# Altium schematic sheet mega128原理图.SchDoc
size A4
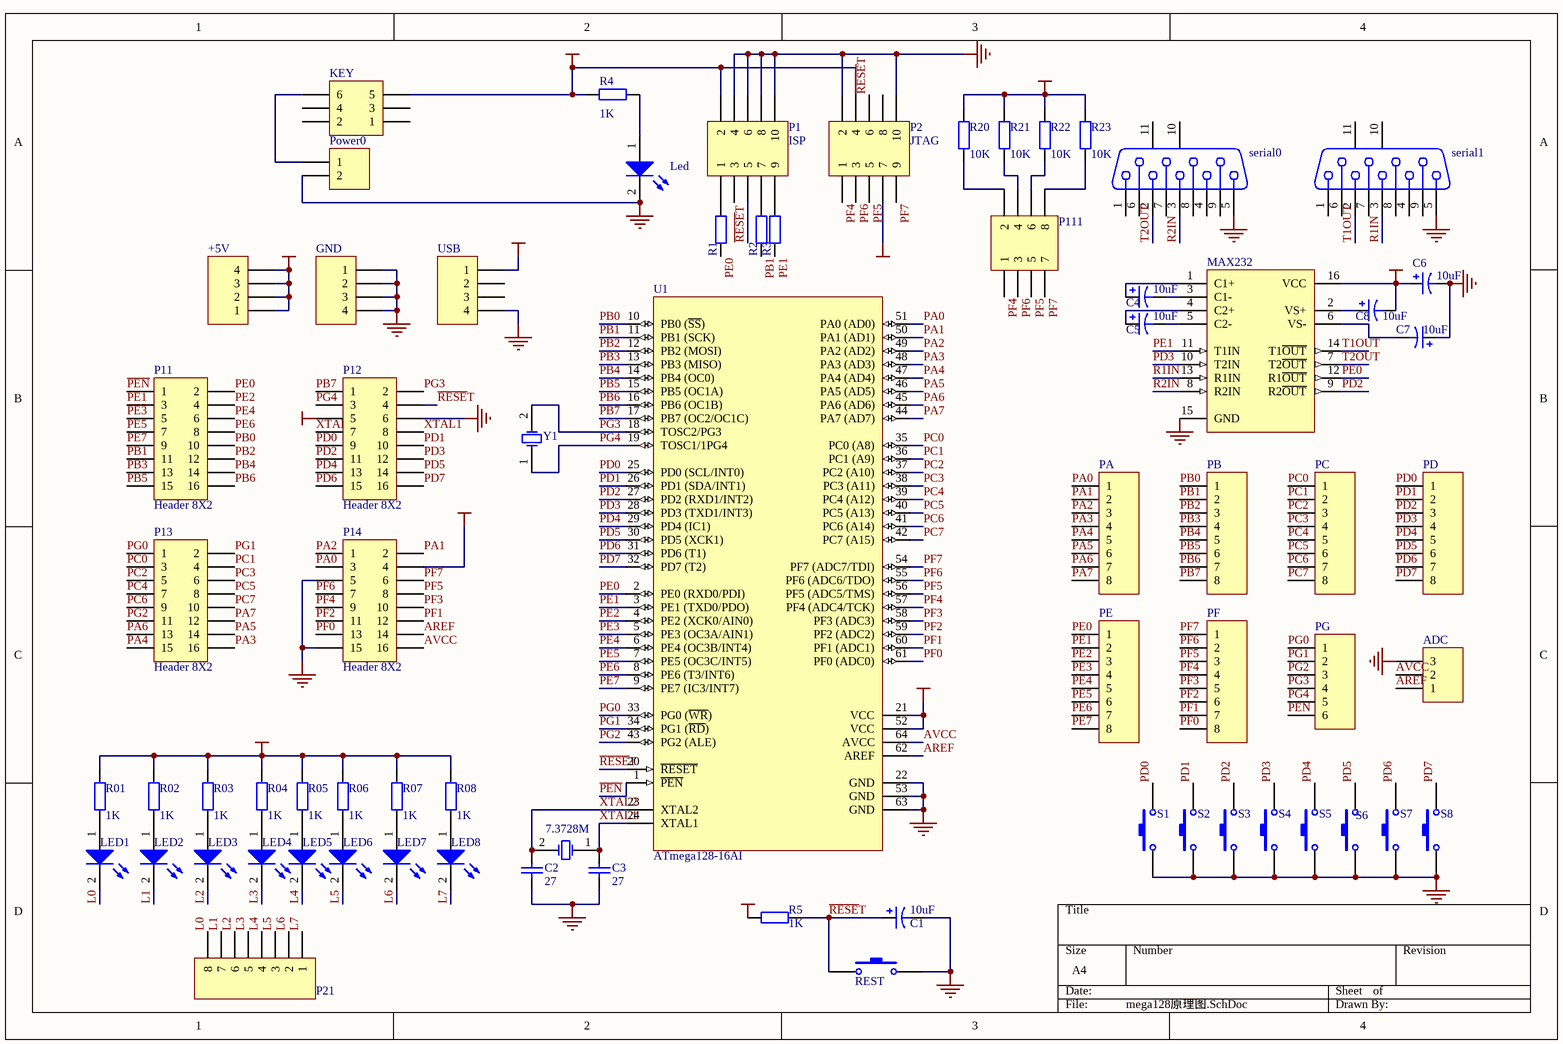
[diagram p0: mega128原理图.SchDoc]

## Parts
7.3728M  JZ  [JZ_ZC]  (value not drawn)
+5V  PZ_4  [HDR-4]  (value not drawn)
ADC  PZ_3  [HDR-3]  (value not drawn)
C1  value 10uF  [C-DJ-4]  (hidden comment: Cap Pol1)
C2  value 27  [CPDR]  (hidden comment: Cap)
C3  value 27  [CPDR]  (hidden comment: Cap)
C4  value 10uF  [C-DJ-4]  (hidden comment: Cap Pol1)
C5  value 10uF  [C-DJ-4]  (hidden comment: Cap Pol1)
C6  value 10uF  [C-DJ-4]  (hidden comment: Cap Pol1)
C7  value 10uF  [C-DJ-4]  (hidden comment: Cap Pol1)
C8  value 10uF  [C-DJ-4]  (hidden comment: Cap Pol1)
GND  PZ_4  [HDR-4]  (value not drawn)
KEY  Header 3X2  [DPDT-6]  (value not drawn)
Led  LED  [TP-0805-R]  (value not drawn)
LED1  LED  [CPDR]  (value not drawn)
LED2  LED  [CPDR]  (value not drawn)
LED3  LED  [CPDR]  (value not drawn)
LED4  LED  [CPDR]  (value not drawn)
LED5  LED  [CPDR]  (value not drawn)
LED6  LED  [CPDR]  (value not drawn)
LED7  LED  [CPDR]  (value not drawn)
LED8  LED  [CPDR]  (value not drawn)
MAX232  MAX232N  [N016]  (value not drawn)
P1  ISP  [HDR-2x5]
P2  JTAG  [HDR-2x5]
P11  Header 8X2  [HDR2X8]
P12  Header 8X2  [HDR2X8]
P13  Header 8X2  [HDR2X8]
P14  Header 8X2  [HDR2X8]
P21  Header 8  [HDR1X8]  (value not drawn)
P111  Header 4X2  [HDR2X4]  (value not drawn)
PA  PZ_8  [HDR-8]  (value not drawn)
PB  PZ_8  [HDR-8]  (value not drawn)
PC  PZ_8  [HDR-8]  (value not drawn)
PD  PZ_8  [HDR-8]  (value not drawn)
PE  PZ_8  [HDR-8]  (value not drawn)
PF  PZ_8  [HDR-8]  (value not drawn)
PG  PZ_6  [HDR-6]  (value not drawn)
Power0  Header 2  [DYDZ]  (value not drawn)
R1  Res2  [TP-0805-R]  (value not drawn)
R01  value 1K  [TP-0805-R]  (hidden comment: Res2)
R2  Res2  [TP-0805-R]  (value not drawn)
R02  value 1K  [TP-0805-R]  (hidden comment: Res2)
R3  Res2  [TP-0805-R]  (value not drawn)
R03  value 1K  [TP-0805-R]  (hidden comment: Res2)
R4  value 1K  [TP-0805-R]  (hidden comment: Res2)
R04  value 1K  [TP-0805-R]  (hidden comment: Res2)
R5  value 1K  [TP-0805-R]  (hidden comment: Res2)
R05  value 1K  [TP-0805-R]  (hidden comment: Res2)
R06  value 1K  [TP-0805-R]  (hidden comment: Res2)
R07  value 1K  [TP-0805-R]  (hidden comment: Res2)
R08  value 1K  [TP-0805-R]  (hidden comment: Res2)
R20  value 10K  [TP-0805-R]  (hidden comment: Res2)
R21  value 10K  [TP-0805-R]  (hidden comment: Res2)
R22  value 10K  [TP-0805-R]  (hidden comment: Res2)
R23  value 10K  [TP-0805-R]  (hidden comment: Res2)
REST  AJKG  [an-6*6]  (value not drawn)
S1  AJKG  [an-6*6]  (value not drawn)
S2  AJKG  [an-6*6]  (value not drawn)
S3  AJKG  [an-6*6]  (value not drawn)
S4  AJKG  [an-6*6]  (value not drawn)
S5  AJKG  [an-6*6]  (value not drawn)
S6  AJKG  [an-6*6]  (value not drawn)
S7  AJKG  [an-6*6]  (value not drawn)
S8  AJKG  [an-6*6]  (value not drawn)
serial0  CKT_9  [COM-9]  (value not drawn)
serial1  CKT_9  [COM-9]  (value not drawn)
U1  ATmega128-16AI  [64A]
USB  PZ_4  [USB-5V]  (value not drawn)
Y1  XTAL  [BCY-W2/D3.1]  (value not drawn)

## Nets
GND: ADC.3 C1.2 C2.1 C3.1 C6.2 C7.1 GND.1 GND.2 GND.3 GND.4 Led.2(K) MAX232.15(GND) P1.4 P1.6 P1.8 P1.10 P2.2 P2.10 P12.6 P14.5 P14.15 Power0.2 REST.1 S1.1 S2.1 S3.1 S4.1 S5.1 S6.1 S7.1 S8.1 serial0.5 serial1.5 U1.22(GND) U1.53(GND) U1.63(GND) USB.4
VCC: +5V.1 +5V.2 +5V.3 +5V.4 C6.1 C8.2 KEY.5 MAX232.16(VCC) P1.2 P2.4 P2.7 P12.5 P14.4 R01.2 R02.2 R03.2 R4.2 R04.2 R5.1 R05.2 R06.2 R07.2 R08.2 R20.2 R21.2 R22.2 R23.2 U1.21(VCC) U1.52(VCC) USB.1
AREF: ADC.1 P14.14 U1.62(AREF)
AVCC: ADC.2 P14.16 U1.64(AVCC)
L0: LED1.2(K) P21.8
L1: LED2.2(K) P21.7
L2: LED3.2(K) P21.6
L3: LED4.2(K) P21.5
L4: LED5.2(K) P21.4
L5: LED6.2(K) P21.3
L6: LED7.2(K) P21.2
L7: LED8.2(K) P21.1
~{PEN}: P11.1 PG.6 U1.1(~{PEN})
PA0: P14.3 PA.1 U1.51(PA0_(AD0))
PA1: P14.2 PA.2 U1.50(PA1_(AD1))
PA2: P14.1 PA.3 U1.49(PA2_(AD2))
PA3: P13.16 PA.4 U1.48(PA3_(AD3))
PA4: P13.15 PA.5 U1.47(PA4_(AD4))
PA5: P13.14 PA.6 U1.46(PA5_(AD5))
PA6: P13.13 PA.7 U1.45(PA6_(AD6))
PA7: P13.12 PA.8 U1.44(PA7_(AD7))
PB0: P11.10 PB.1 U1.10(PB0_(~{SS}))
PB1: P11.11 PB.2 R2.1 U1.11(PB1_(SCK))
PB2: P11.12 PB.3 U1.12(PB2_(MOSI))
PB3: P11.13 PB.4 U1.13(PB3_(MISO))
PB4: P11.14 PB.5 U1.14(PB4_(OC0))
PB5: P11.15 PB.6 U1.15(PB5_(OC1A))
PB6: P11.16 PB.7 U1.16(PB6_(OC1B))
PB7: P12.1 PB.8 U1.17(PB7_(OC2/OC1C))
PC0: P13.3 PC.1 U1.35(PC0_(A8))
PC1: P13.4 PC.2 U1.36(PC1_(A9))
PC2: P13.5 PC.3 U1.37(PC2_(A10))
PC3: P13.6 PC.4 U1.38(PC3_(A11))
PC4: P13.7 PC.5 U1.39(PC4_(A12))
PC5: P13.8 PC.6 U1.40(PC5_(A13))
PC6: P13.9 PC.7 U1.41(PC6_(A14))
PC7: P13.10 PC.8 U1.42(PC7_(A15))
PD0: P12.9 PD.1 S1.2 U1.25(PD0_(SCL/INT0))
PD1: P12.10 PD.2 S2.2 U1.26(PD1_(SDA/INT1))
PD2: MAX232.9(R2~{OUT}) P12.11 PD.3 S3.2 U1.27(PD2_(RXD1/INT2))
PD3: MAX232.10(T2IN) P12.12 PD.4 S4.2 U1.28(PD3_(TXD1/INT3))
PD4: P12.13 PD.5 S5.2 U1.29(PD4_(IC1))
PD5: P12.14 PD.6 S6.2 U1.30(PD5_(XCK1))
PD6: P12.15 PD.7 S7.2 U1.31(PD6_(T1))
PD7: P12.16 PD.8 S8.2 U1.32(PD7_(T2))
PE0: MAX232.12(R1~{OUT}) P11.2 PE.1 R1.1 U1.2(PE0_(RXD0/PDI))
PE1: MAX232.11(T1IN) P11.3 PE.2 R3.1 U1.3(PE1_(TXD0/PDO))
PE2: P11.4 PE.3 U1.4(PE2_(XCK0/AIN0))
PE3: P11.5 PE.4 U1.5(PE3_(OC3A/AIN1))
PE4: P11.6 PE.5 U1.6(PE4_(OC3B/INT4))
PE5: P11.7 PE.6 U1.7(PE5_(OC3C/INT5))
PE6: P11.8 PE.7 U1.8(PE6_(T3/INT6))
PE7: P11.9 PE.8 U1.9(PE7_(IC3/INT7))
PF0: P14.13 PF.8 U1.61(PF0_(ADC0))
PF1: P14.12 PF.7 U1.60(PF1_(ADC1))
PF2: P14.11 PF.6 U1.59(PF2_(ADC2))
PF3: P14.10 PF.5 U1.58(PF3_(ADC3))
PF4: P2.1 P14.9 P111.1 PF.4 U1.57(PF4_(ADC4/TCK))
PF5: P2.5 P14.8 P111.5 PF.3 U1.56(PF5_(ADC5/TMS))
PF6: P2.3 P14.7 P111.3 PF.2 U1.55(PF6_(ADC6/TDO))
PF7: P2.9 P14.6 P111.7 PF.1 U1.54(PF7_(ADC7/TDI))
PG0: P13.1 PG.1 U1.33(PG0_(~{WR}))
PG1: P13.2 PG.2 U1.34(PG1_(~{RD}))
PG2: P13.11 PG.3 U1.43(PG2_(ALE))
PG3: P12.2 PG.4 U1.18(TOSC2/PG3) Y1.2(OSC2)
PG4: P12.3 PG.5 U1.19(TOSC1/1PG4) Y1.1(OSC1)
R1IN: MAX232.13(R1IN) serial1.3
R2IN: MAX232.8(R2IN) serial0.3
~{RESE}T: C1.1 P1.5 P2.6 P12.4 R5.2 REST.2 U1.20(~{RESET})
T1OUT: MAX232.14(T1~{OUT}) serial1.2
T2OUT: MAX232.7(T2~{OUT}) serial0.2
XTAL1: 7.3728M.1(OSC1) C3.2 P12.8 U1.24(XTAL1)
XTAL2: 7.3728M.2(OSC2) C2.2 P12.7 U1.23(XTAL2)
NetC4_1: C4.1 MAX232.1(C1+)
NetC4_2: C4.2 MAX232.3(C1-)
NetC5_1: C5.1 MAX232.4(C2+)
NetC5_2: C5.2 MAX232.5(C2-)
NetC7_2: C7.2 MAX232.6(VS-)
NetC8_1: C8.1 MAX232.2(VS+)
NetKEY_6: KEY.6 Power0.1
NetLED1_1: LED1.1(A) R01.1
NetLED2_1: LED2.1(A) R02.1
NetLED3_1: LED3.1(A) R03.1
NetLED4_1: LED4.1(A) R04.1
NetLED5_1: LED5.1(A) R05.1
NetLED6_1: LED6.1(A) R06.1
NetLED7_1: LED7.1(A) R07.1
NetLED8_1: LED8.1(A) R08.1
NetLed_1: Led.1(A) R4.1
NetP1_1: P1.1 R1.2
NetP1_7: P1.7 R2.2
NetP1_9: P1.9 R3.2
NetP111_2: P111.2 R20.1
NetP111_4: P111.4 R21.1
NetP111_6: P111.6 R22.1
NetP111_8: P111.8 R23.1

Not connected (* = marked no-connect by the designer): KEY 1 2 3 4; P1 3; P2 8; serial0 1 4 6 7 8 9 10(MH1) 11(MH2); serial1 1 4 6 7 8 9 10(MH1) 11(MH2); USB 2 3

## Library data of the parts
7.3728M = JZ: 晶振; Published: 8-Jun-2000; LatestRevisionDate: 17-Jul-2002; LatestRevisionNote: Re-released for DXP Platform.; Publisher: Altium Limited
+5V GND USB = PZ_4: 排针——4; LatestRevisionDate: 17-Jul-2002; LatestRevisionNote: Re-released for DXP Platform.; Publisher: Altium Limited
ADC = PZ_3: 排针——3; LatestRevisionDate: 17-Jul-2002; LatestRevisionNote: Re-released for DXP Platform.; Publisher: Altium Limited
C1 C4-C8 = Cap Pol1: Polarized Capacitor (Radial); Published: 8-Jun-2000; LatestRevisionDate: 17-Jul-2002; LatestRevisionNote: Re-released for DXP Platform.; Publisher: Altium Limited
C2 C3 = Cap: Capacitor; Published: 8-Jun-2000; LatestRevisionDate: 17-Jul-2002; LatestRevisionNote: Re-released for DXP Platform.; Publisher: Altium Limited
KEY = Header 3X2: Header, 3-Pin, Dual row; LatestRevisionDate: 17-Jul-2002; LatestRevisionNote: Re-released for DXP Platform.; Publisher: Altium Limited
Led LED1-LED8 = LED: 发光二极管; Published: 8-Jun-2000; LatestRevisionDate: 17-Jul-2002; LatestRevisionNote: Re-released for DXP Platform.; Publisher: Altium Limited
MAX232 = MAX232N: Dual EIA-232 Driver/Receiver; Note: Receivers have typical hysteresis of 0.5V; Published: 15-May-2002; DatasheetDocument: Jun-1989; PackageDocument: Oct-1995; PackageReference: N016; Publisher: Altium Limited; Code_JEDEC: MS-001-BB
P1 P2 = Header 5X2: Header, 5-Pin, Dual row; LatestRevisionDate: 17-Jul-2002; LatestRevisionNote: Re-released for DXP Platform.; Publisher: Altium Limited
P11-P14 = Header 8X2: Header, 8-Pin, Dual row; LatestRevisionDate: 17-Jul-2002; LatestRevisionNote: Re-released for DXP Platform.; Publisher: Altium Limited
P21 = Header 8: Header, 8-Pin; LatestRevisionDate: 17-Jul-2002; LatestRevisionNote: Re-released for DXP Platform.; Publisher: Altium Limited
P111 = Header 4X2: Header, 4-Pin, Dual row; LatestRevisionDate: 17-Jul-2002; LatestRevisionNote: Re-released for DXP Platform.; Publisher: Altium Limited
PA PB PC PD PE PF = PZ_8: 排针——8; LatestRevisionDate: 17-Jul-2002; LatestRevisionNote: Re-released for DXP Platform.; Publisher: Altium Limited
PG = PZ_6: 排针——6; LatestRevisionDate: 17-Jul-2002; LatestRevisionNote: Re-released for DXP Platform.; Publisher: Altium Limited
Power0 = Header 2: Header, 2-Pin; LatestRevisionDate: 17-Jul-2002; LatestRevisionNote: Re-released for DXP Platform.; Publisher: Altium Limited
R1-R3 = Res2: Resistor; Value: 470; Published: 8-Jun-2000; LatestRevisionDate: 17-Jul-2002; LatestRevisionNote: Re-released for DXP Platform.; Publisher: Altium Limited
R01 R02 R03 R4 R04 R5 R05 R06 R07 R08 R20-R23 = Res2: Resistor; Published: 8-Jun-2000; LatestRevisionDate: 17-Jul-2002; LatestRevisionNote: Re-released for DXP Platform.; Publisher: Altium Limited
REST S1-S8 = AJKG: 按键开关; Published: 24-Mar-1999; LatestRevisionDate: 17-Jul-2002; LatestRevisionNote: Re-released for DXP Platform.; Publisher: Altium Limited
serial0 serial1 = CKT_9: 9针串口头_母; PackageDocument: O; Positions: 9; Gender: Receptacle; Published: 15-Jun-2001; LatestRevisionDate: 17-Jul-2002; LatestRevisionNote: Re-released for DXP Platform.; DatasheetDocument: 1-Sep-1999; PackageReference: 788750; Publisher: Altium Limited; Orientation: Right Angle
U1 = ATmega128-16AI: 8-Bit AVR Microcontroller with 128K Bytes of In-System Programmable Flash Memory; PackageDocument: revB, Oct-2001; Published: 17-Sep-2003; LatestRevisionDate: 4-Mar-2005; LatestRevisionNote: Stylized 3D Model Added.; DatasheetDocument: 2467G-AVR-09/02; PackageReference: 64A; Publisher: Altium Limited; Code_JEDEC: MS-026-AEB; ComponentLink1Description: Manufacturer Link; ComponentLink1URL: http://www.atmel.com; ComponentLink2Description: Datasheet; ComponentLink2URL: http://www.atmel.com/dyn/resources/prod_documents/doc2467.pdf
Y1 = XTAL: Crystal Oscillator; Published: 8-Jun-2000; LatestRevisionDate: 17-Jul-2002; LatestRevisionNote: Re-released for DXP Platform.; Publisher: Altium Limited